# Altium schematic sheet Controles.SchDoc
size Letter; Organization: Cegep Limoilou; Address1: 1300, 8e Avenue; Address2: Québec, QC; Address3: Canada; Address4: G1J 5L5; Revision: Révision?; SheetNumber: 2; SheetTotal: 2; Conception: Conception?; Titre: Titre?; Modification: Modification?; SPICEModelCacheSUUBYXOL: <root> / <DocumentId>SUUBYXOL</DocumentId> / </root>
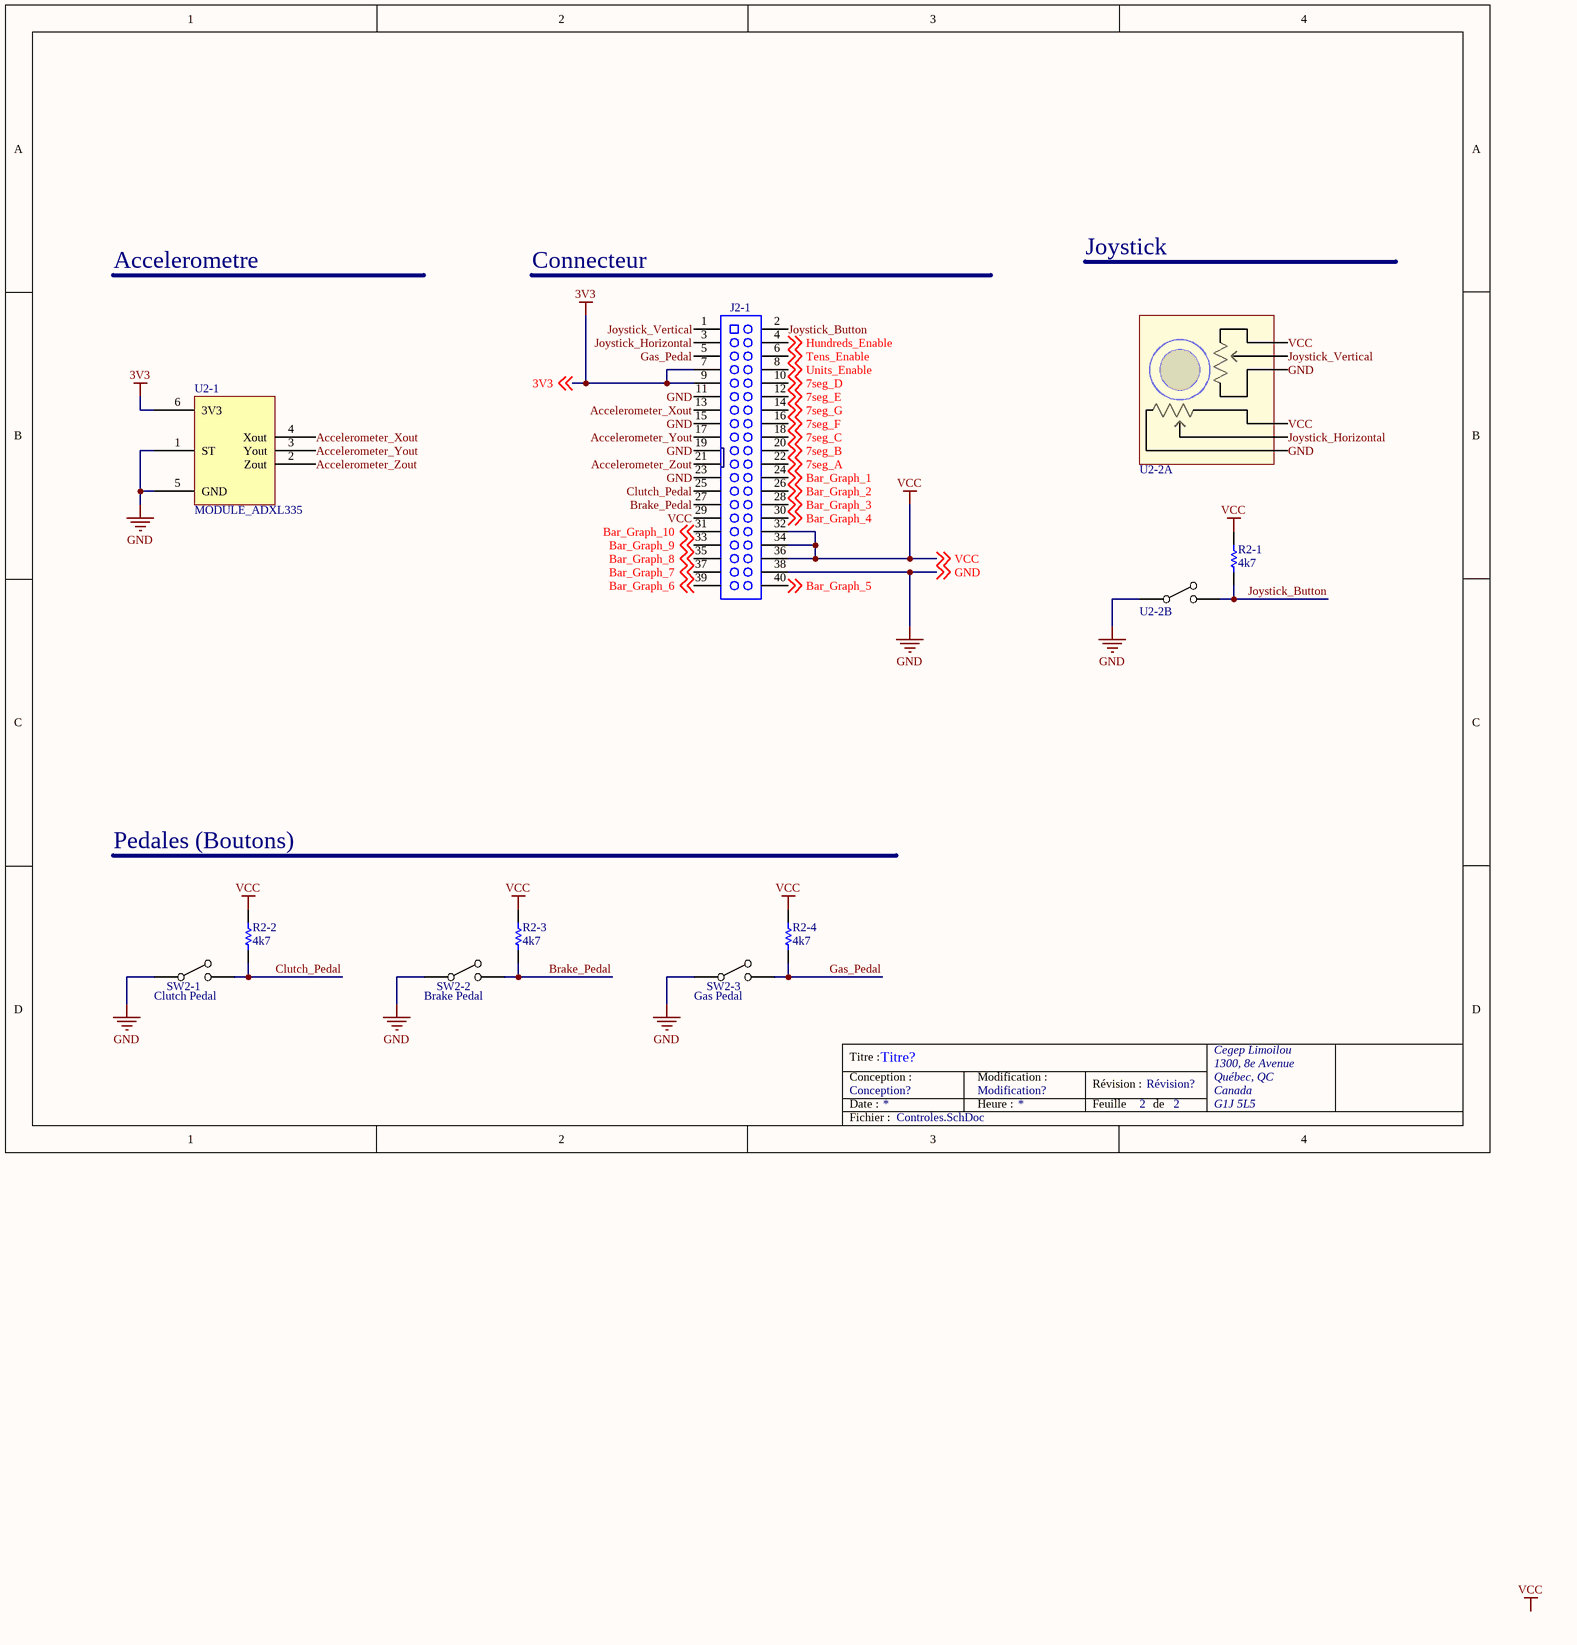
[diagram p0: Controles.SchDoc]

## Parts
J2-1  Header  [CONN_HDR_100mils_2x20]  (value not drawn)
R2-1  value 4k7  [AXIAL-0.3]  (hidden comment: Res1)
R2-2  value 4k7  [AXIAL-0.3]  (hidden comment: Res1)
R2-3  value 4k7  [AXIAL-0.3]  (hidden comment: Res1)
R2-4  value 4k7  [AXIAL-0.3]  (hidden comment: Res1)
SW2-1  Clutch Pedal  [BUTTON_SPST_WS-TATV]
SW2-2  Brake Pedal  [BUTTON_SPST_WS-TATV]
SW2-3  Gas Pedal  [BUTTON_SPST_WS-TATV]
U2-1  MODULE_ADXL335  [MODULE_ADXL335]
U2-2  Dual-axis joystick  [BTN_JOYSTICK_COM-09032]  (value not drawn)  (parts A,B of 2)

## Nets
3V3: J2-1.7 J2-1.9 U2-1.6(3V3) ; off-sheet 3V3
GND: J2-1.11 J2-1.15 J2-1.19 J2-1.23 J2-1.38 SW2-1.1 SW2-2.1 SW2-3.1 U2-1.1(ST) U2-1.5(GND) U2-2.SW_A(A) U2-2.X1(CCW) U2-2.Y1(CCW) ; off-sheet GND
VCC: J2-1.29 J2-1.32 J2-1.34 J2-1.36 R2-1.2 R2-2.2 R2-3.2 R2-4.2 U2-2.X3(CW) U2-2.Y3(CW) ; off-sheet VCC
7seg_A: J2-1.22 ; off-sheet 7seg_A
7seg_B: J2-1.20 ; off-sheet 7seg_B
7seg_C: J2-1.18 ; off-sheet 7seg_C
7seg_D: J2-1.10 ; off-sheet 7seg_D
7seg_E: J2-1.12 ; off-sheet 7seg_E
7seg_F: J2-1.16 ; off-sheet 7seg_F
7seg_G: J2-1.14 ; off-sheet 7seg_G
Accelerometer_Xout: J2-1.13 U2-1.4(Xout)
Accelerometer_Yout: J2-1.17 U2-1.3(Yout)
Accelerometer_Zout: J2-1.21 U2-1.2(Zout)
Bar_Graph_1: J2-1.24 ; off-sheet Bar_Graph_1
Bar_Graph_2: J2-1.26 ; off-sheet Bar_Graph_2
Bar_Graph_3: J2-1.28 ; off-sheet Bar_Graph_3
Bar_Graph_4: J2-1.30 ; off-sheet Bar_Graph_4
Bar_Graph_5: J2-1.40 ; off-sheet Bar_Graph_5
Bar_Graph_6: J2-1.39 ; off-sheet Bar_Graph_6
Bar_Graph_7: J2-1.37 ; off-sheet Bar_Graph_7
Bar_Graph_8: J2-1.35 ; off-sheet Bar_Graph_8
Bar_Graph_9: J2-1.33 ; off-sheet Bar_Graph_9
Bar_Graph_10: J2-1.31 ; off-sheet Bar_Graph_10
Brake_Pedal: J2-1.27 R2-3.1 SW2-2.2
Clutch_Pedal: J2-1.25 R2-2.1 SW2-1.2
Gas_Pedal: J2-1.5 R2-4.1 SW2-3.2
Hundreds_Enable: J2-1.4 ; off-sheet Hundreds_Enable
Joystick_Button: J2-1.2 R2-1.1 U2-2.SW_B(B)
Joystick_Horizontal: J2-1.3 U2-2.X2(W)
Joystick_Vertical: J2-1.1 U2-2.Y2(W)
Tens_Enable: J2-1.6 ; off-sheet Tens_Enable
Units_Enable: J2-1.8 ; off-sheet Units_Enable

## Notes on the sheet
- Accelerometre
- Connecteur
- Joystick
- Pedales (Boutons)
- Labels drawn without touching a wire or pin: VCC
- Titre :
- Conception :
- Date :
- Modification :
- Heure :
- Révision :
- Feuille
- de
- Fichier :

## Library data of the parts
J2-1 = CONN_DUALROW_2x20: IDC Boxed Header, Straight, PCB Mount, Polarised, 40 Way, 2x20, 0.1" Pitch; Mfg: Sullins; Mfg_PN: SBH11-PBPC-D20-ST-BK; Supplier1: Digikey; Supplier1_PN: S9175-ND
R2-1-R2-4 = Res1: Resistor; Published: 8-Jun-2000; LatestRevisionDate: 17-Jul-2002; LatestRevisionNote: Re-released for DXP Platform.; PackageReference: AXIAL-0.3; Publisher: Altium Limited; PackageDescription: Axial Device, Thru-Hole; 2 Leads; 0.3 in Pin Spacing
SW2-1-SW2-3 = BTN_SPST: SPST Button; Mfg: Wurth; Mfg_PN: 430186070716; Supplier1: Digikey; Supplier1_PN: 430186070716-ND
U2-1 = MODULE_ADXL335: Accelerometre
U2-2 = BTN_JOYSTICK_COM-09032: Joystick deux-axes, sorties "potentiometres"; Mfg: Sparkfun; Supplier1_PN: 1568-1526-ND; Supplier1: Digikey; Mfg_PN: COM-09032